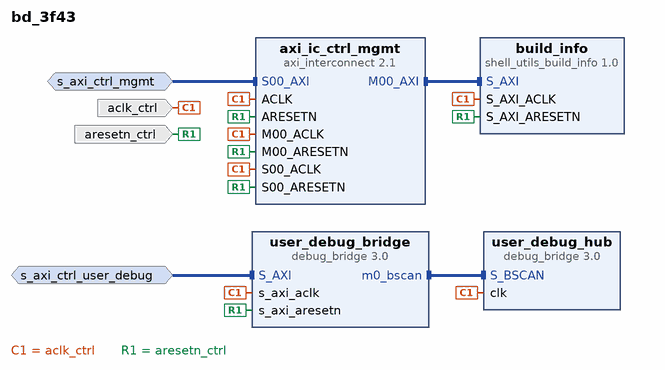
[diagram p0: block diagram of the top level]
# Vivado block design bd_3f43, xcu250-figd2104-2L-e, Vivado 2022.2
create_bd_design bd_3f43

create_bd_intf_port -mode Slave -vlnv xilinx.com:interface:aximm_rtl:1.0 s_axi_ctrl_mgmt
set_property -dict [list \
  CONFIG.ADDR_WIDTH 25 \
  CONFIG.DATA_WIDTH 32 \
  CONFIG.HAS_BURST 0 \
  CONFIG.HAS_CACHE 0 \
  CONFIG.HAS_LOCK 0 \
  CONFIG.HAS_QOS 0 \
  CONFIG.INSERT_VIP 1 \
  CONFIG.MAX_BURST_LENGTH 1 \
  CONFIG.PROTOCOL AXI4LITE \
  CONFIG.SUPPORTS_NARROW_BURST 0 \
] [get_bd_intf_ports s_axi_ctrl_mgmt]
create_bd_intf_port -mode Slave -vlnv xilinx.com:interface:aximm_rtl:1.0 s_axi_ctrl_user_debug
set_property -dict [list \
  CONFIG.ADDR_WIDTH 25 \
  CONFIG.ASSOCIATED_BUSIF S_AXI \
  CONFIG.DATA_WIDTH 32 \
  CONFIG.HAS_BURST 0 \
  CONFIG.HAS_CACHE 0 \
  CONFIG.HAS_LOCK 0 \
  CONFIG.HAS_QOS 0 \
  CONFIG.INSERT_VIP 1 \
  CONFIG.MAX_BURST_LENGTH 1 \
  CONFIG.PROTOCOL AXI4LITE \
  CONFIG.SUPPORTS_NARROW_BURST 0 \
] [get_bd_intf_ports s_axi_ctrl_user_debug]
create_bd_port -dir I -type clk aclk_ctrl
set_property -dict [list \
  CONFIG.ASSOCIATED_BUSIF s_axi_ctrl_mgmt:s_axi_ctrl_user_debug \
  CONFIG.ASSOCIATED_RESET aresetn_ctrl \
] [get_bd_ports aclk_ctrl]
create_bd_port -dir I -type rst aresetn_ctrl
set_property -dict {CONFIG.POLARITY ACTIVE_LOW} [get_bd_ports aresetn_ctrl]

create_bd_cell -type ip -vlnv xilinx.com:ip:shell_utils_build_info:1.0 build_info
set_property -dict [list \
  CONFIG.C_CORE_REVISION 6 \
  CONFIG.C_MAJOR_VERSION 3 \
  CONFIG.C_MINOR_VERSION 0 \
  CONFIG.C_PATCH_REVISION 0 \
  CONFIG.C_PERFORCE_CL 3478949 \
  CONFIG.C_RESERVED_TAG 0x00000000 \
  CONFIG.C_SUBSYSTEM_ID 0x03 \
  CONFIG.C_VIV_VERSION 0x202210 \
] [get_bd_cells build_info]
create_bd_cell -type ip -vlnv xilinx.com:ip:axi_interconnect:2.1 axi_ic_ctrl_mgmt
set_property -dict {CONFIG.NUM_MI 1} [get_bd_cells axi_ic_ctrl_mgmt]
create_bd_cell -type ip -vlnv xilinx.com:ip:debug_bridge:3.0 user_debug_bridge
set_property -dict {CONFIG.C_DEBUG_MODE 2 CONFIG.C_DESIGN_TYPE 1 CONFIG.C_NUM_BS_MASTER 1} [get_bd_cells user_debug_bridge]
create_bd_cell -type ip -vlnv xilinx.com:ip:debug_bridge:3.0 user_debug_hub
set_property -dict {CONFIG.C_DESIGN_TYPE 1 CONFIG.C_NUM_BS_MASTER 0} [get_bd_cells user_debug_hub]

# ---- connections ----

connect_bd_intf_net -intf_net axi_ic_mgmt_M00_AXI [get_bd_intf_pins axi_ic_ctrl_mgmt/M00_AXI] [get_bd_intf_pins build_info/S_AXI]
connect_bd_intf_net -intf_net s_axi_ctrl_mgmt_net [get_bd_intf_ports s_axi_ctrl_mgmt] [get_bd_intf_pins axi_ic_ctrl_mgmt/S00_AXI]
connect_bd_intf_net -intf_net s_axi_ctrl_user_debug_net [get_bd_intf_ports s_axi_ctrl_user_debug] [get_bd_intf_pins user_debug_bridge/S_AXI]
connect_bd_intf_net [get_bd_intf_pins user_debug_bridge/m0_bscan] [get_bd_intf_pins user_debug_hub/S_BSCAN]
connect_bd_net -net aclk_ctrl_mgmt_net [get_bd_ports aclk_ctrl] \
  [get_bd_pins axi_ic_ctrl_mgmt/ACLK] [get_bd_pins axi_ic_ctrl_mgmt/S00_ACLK] [get_bd_pins axi_ic_ctrl_mgmt/M00_ACLK] \
  [get_bd_pins user_debug_bridge/s_axi_aclk] [get_bd_pins user_debug_hub/clk] [get_bd_pins build_info/S_AXI_ACLK]
connect_bd_net -net aresetn_ctrl_mgmt_net [get_bd_ports aresetn_ctrl] \
  [get_bd_pins axi_ic_ctrl_mgmt/ARESETN] [get_bd_pins axi_ic_ctrl_mgmt/S00_ARESETN] \
  [get_bd_pins axi_ic_ctrl_mgmt/M00_ARESETN] [get_bd_pins user_debug_bridge/s_axi_aresetn] \
  [get_bd_pins build_info/S_AXI_ARESETN]

# ---- address map ----
assign_bd_address -offset 0x1020000 -range 4K -target_address_space [get_bd_addr_spaces s_axi_ctrl_mgmt] [get_bd_addr_segs build_info/S_AXI/reg0]
assign_bd_address -offset 0x1C00000 -range 64K -target_address_space [get_bd_addr_spaces s_axi_ctrl_user_debug] [get_bd_addr_segs user_debug_bridge/S_AXI/Reg0]

validate_bd_design
save_bd_design
